# EAGLE design RPi-UKHASnet-node (EAGLE 7.4.0)
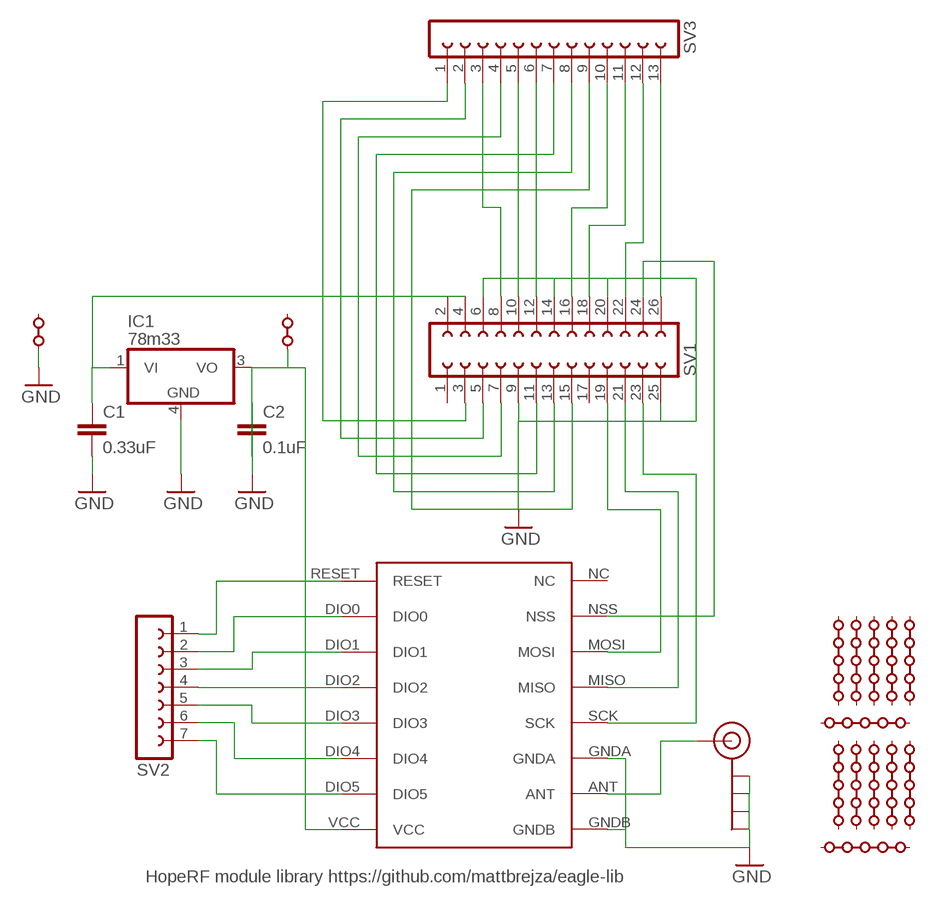
[diagram p0: schematic, sheet 1]

## Parts
C1  0.33uF  C-EUC1206  [C1206]
C2  0.1uF  C-EUC1206  [C1206]
IC1  78m33  LM340MP-05  [SOT223]
J$1  SMA_EDGE  [SMA-EDGE]
P1  PADSTRIP5-VA  [PADSTRIP-5V]
P2  PADSTRIP5-VA  [PADSTRIP-5V]
P3  PADSTRIP5-VA  [PADSTRIP-5V]
P4  PADSTRIP5-VA  [PADSTRIP-5V]
P5  PADSTRIP5-VA  [PADSTRIP-5V]
P9  PADSTRIP5-VA  [PADSTRIP-5V]
P10  PADSTRIP5-VA  [PADSTRIP-5V]
P11  PADSTRIP5-VA  [PADSTRIP-5V]
P12  PADSTRIP5-VA  [PADSTRIP-5V]
P13  PADSTRIP5-VA  [PADSTRIP-5V]
P17  PADSTRIP5-VA  [PADSTRIP-5V]
P18  PADSTRIP5-VA  [PADSTRIP-5V]
PR8  PADSTRIP2-H  [PADSTRIP-2H]
PR20  PADSTRIP2-H  [PADSTRIP-2H]
SV1  FE13-2  [FE13-2]
SV2  FE07-1  [FE07]
SV3  FE13-1  [FE13]
U1  RFM69HW  [RFM]

## Nets
GND: C1.2 C2.1 IC1.4(GND) J$1.GND@0(GND) J$1.GND@1(GND) J$1.GND@2(GND) J$1.GND@3(GND) PR20.1(LFT) SV1.6 SV1.9 SV1.14 SV1.20 SV1.25 U1.GNDA U1.GNDB
N$1: J$1.SIG(SIGNAL) U1.ANT
N$2: SV2.7 U1.DIO5
N$3: SV2.6 U1.DIO4
N$4: SV2.5 U1.DIO3
N$5: SV2.4 U1.DIO2
N$6: SV2.3 U1.DIO1
N$7: SV2.2 U1.DIO0
N$8: SV1.24 U1.NSS
N$9: SV1.23 U1.SCK
N$10: SV1.21 U1.MISO
N$11: SV1.19 U1.MOSI
N$12: SV1.3 SV3.1
N$13: C1.1 IC1.1(VI) SV1.2 SV1.4
N$14: C2.2 IC1.3(VO) PR8.1(LFT) U1.VCC
N$15: SV2.1 U1.RESET
N$16: SV1.5 SV3.2
N$17: SV1.7 SV3.4
N$18: SV1.11 SV3.7
N$19: SV1.13 SV3.8
N$20: SV1.15 SV3.9
N$21: SV1.8 SV3.3
N$22: SV1.10 SV3.5
N$23: SV1.12 SV3.6
N$24: SV1.16 SV3.10
N$25: SV1.18 SV3.11
N$26: SV1.22 SV3.12
N$27: SV1.26 SV3.13
Unconnected: P1.1 P1.5 P2.1 P2.5 P3.1 P3.5 P4.1 P4.5 P5.1 P5.5 P9.1 P9.5 P10.1 P10.5 P11.1 P11.5 P12.1 P12.5 P13.1 P13.5 P17.1 P17.5 P18.1 P18.5 PR8.2(RIT) PR20.2(RIT) SV1.1 SV1.17 U1.NC

## Notes on the sheet
- HopeRF module library https://github.com/mattbrejza/eagle-lib

## Library data of the parts
C1 C2 = rcl:C-EU: CAPACITOR, European symbol
IC1 = linear:LM340?-*: Positive VOLTAGE REGULATOR Source: http://cache.national.com/ds/LM/LM340.pdf
J$1 = SparkFun-Connectors:SMA_EDGE: SMA Antenna Connector End launch SMA connector. The paste layer has been removed so that the connector can be hand soldered onto the board after reflow.
P1-P5 P9-P13 P17 P18 = proto:PADSTRIP5-V: Strip of 5 connected pads; BOM: no; VALSTAT: label
PR8 PR20 = proto:PADSTRIP2-H: Strip of 2 connected pads; BOM: no; VALSTAT: label
SV1 = con-lsta:FE13-2: FEMALE HEADER; OC_FARNELL: unknown; OC_NEWARK: unknown
SV2 = con-lsta:FE07-1: FEMALE HEADER; OC_FARNELL: unknown; OC_NEWARK: unknown
SV3 = con-lsta:FE13-1: FEMALE HEADER; OC_FARNELL: unknown; OC_NEWARK: unknown
U1 = hoperf:RFM69HW

## Board
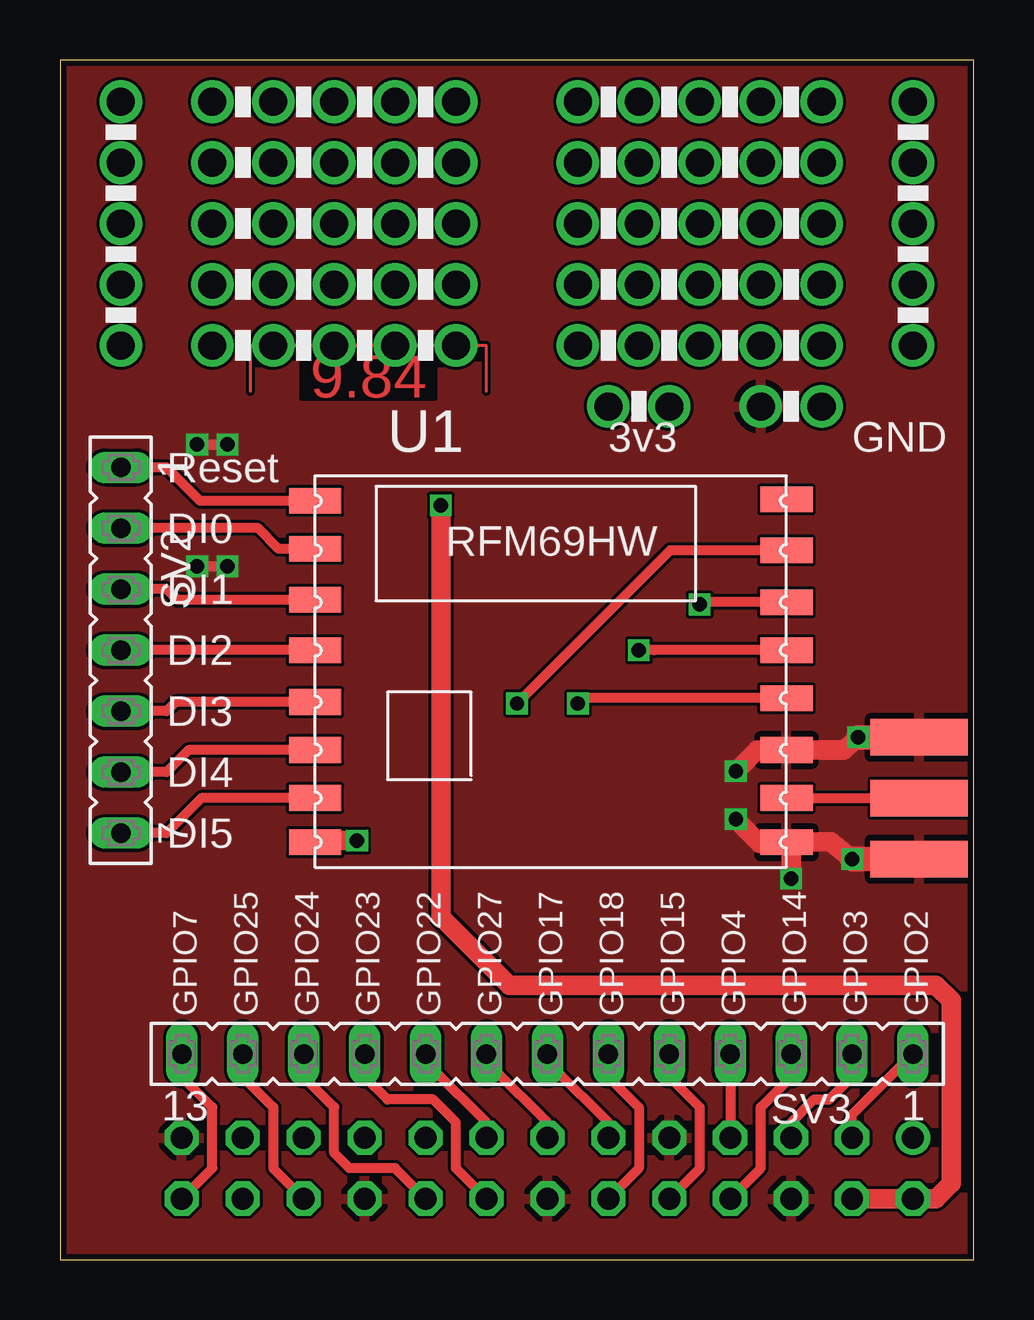
[diagram p1: board, top side]
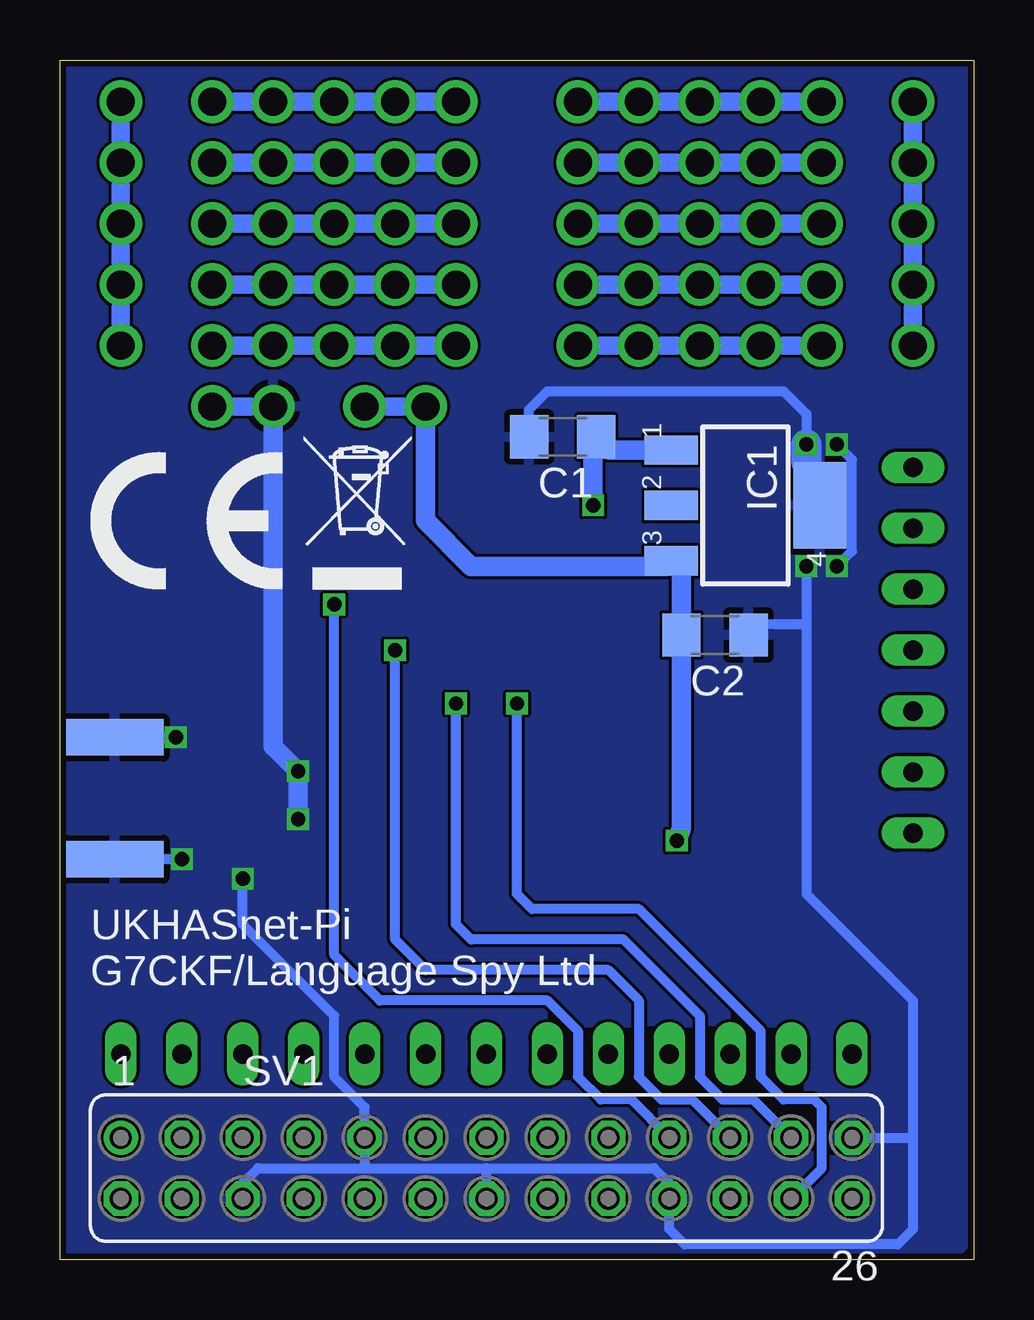
[diagram p2: board, bottom side, seen from below]

Size 38.1 x 50 mm. Coordinates in mm from the lower left corner, seen from the top.
Outline: 0,0 38.1,0 38.1,50 0,50 0,0
Copper layers (1*16): Top 0.035mm / dielectric 1.5mm / Bottom 0.035mm
Design rules "dirt_cheap_dirty_boards.v1": minimum track width 5mil, minimum drill 12mil, track to track 5mil, track to pad 5mil, pad to pad 5mil, via to via 5mil, smd to smd 0mil, copper to edge 10mil, drill to drill 10mil, minimum pad ring 10mil, minimum via ring 6mil, stop-mask expansion 2mil, vias tented up to drill 25mil, thermal gap 10mil

### Footprints (pad centres in the part's own frame; a part is rotated, then mirrored left to right if it is on the bottom)
C1206 = smd 1.6 x 1.8: 1 -1.4,0; 2 1.4,0
SOT223 = smd 1.219 x 2.235: 1 -2.311,-3.099; 2 0,-3.099; 3 2.311,-3.099 | smd 3.6 x 2.2: 4 0,3.099
SMA-EDGE = smd 1.524 x 4.064: GND@0 0,0; GND@1 5.08,0; SIG 2.54,0 | smd 1.524 x 4.064 bottom: GND@2 0,0; GND@3 5.08,0
PADSTRIP-5V = drill 1.168 pad 1.778: 1 0,5.08; 2 0,2.54; 3 0,0; 4 0,-2.54; 5 0,-5.08
PADSTRIP-2H = drill 1.168 pad 1.778: 1 0,0; 2 2.54,0
FE13-2 = drill 0.914: 1 -15.24,1.27 | drill 0.914 octagon: 2 -15.24,-1.27; 3 -12.7,1.27; 4 -12.7,-1.27; 5 -10.16,1.27; 6 -10.16,-1.27; 7 -7.62,1.27; 8 -7.62,-1.27; 9 -5.08,1.27; 10 -5.08,-1.27; 11 -2.54,1.27; 12 -2.54,-1.27; 13 0,1.27; 14 0,-1.27; 15 2.54,1.27; 16 2.54,-1.27; 17 5.08,1.27; 18 5.08,-1.27; 19 7.62,1.27; 20 7.62,-1.27; 21 10.16,1.27; 22 10.16,-1.27; 23 12.7,1.27; 24 12.7,-1.27; 25 15.24,1.27; 26 15.24,-1.27
FE07 = drill 0.813 long: 1 -7.62,0; 2 -5.08,0; 3 -2.54,0; 4 0,0; 5 2.54,0; 6 5.08,0; 7 7.62,0
FE13 = drill 0.813 long: 1 -15.24,0; 2 -12.7,0; 3 -10.16,0; 4 -7.62,0; 5 -5.08,0; 6 -2.54,0; 7 0,0; 8 2.54,0; 9 5.08,0; 10 7.62,0; 11 10.16,0; 12 12.7,0; 13 15.24,0
RFM = smd 2.184 x 1.067: ANT 19.651,2.889; DIO0 0,13.27; DIO1 0,11.143; DIO2 0,9.047; DIO3 0,6.889; DIO4 0,4.889; DIO5 0,2.889; GNDA 19.651,4.889; GNDB 19.651,1.048; MISO 19.651,9.047; MOSI 19.651,11.047; NC 19.651,15.334; NSS 19.651,13.206; RESET 0,15.27; SCK 19.651,7.048; VCC 0,1.048

### Placement (x,y rotation side)
C1  17.14,34.29 180 bottom
C2  10.79,26.04 180 bottom
IC1  9.53,31.43 270 bottom
J$1  35.81,16.69 90 top
P1  11.43,48.26 90 top
P2  11.43,45.72 90 top
P3  11.43,43.18 90 top
P4  11.43,40.64 90 top
P5  11.43,38.1 90 top
P9  26.67,48.26 90 top
P10  26.67,45.72 90 top
P11  26.67,43.18 90 top
P12  26.67,40.64 90 top
P13  26.67,38.1 90 top
P17  2.54,43.18 0 top
P18  35.56,43.18 0 top
PR8  22.86,35.56 0 top
PR20  29.21,35.56 0 top
SV1  20.32,3.81 0 bottom
SV2  2.54,25.4 270 top
SV3  20.32,8.57 180 top
U1  10.63,16.35 0 top
U$2  [CE-LOGO]  36.83,27.94 0 bottom
U$3  [WEE-LOGO]  27.94,27.94 0 bottom

### Tracks (layer width: path | path; a pad name or v marks a point on that pad's centre or on a via)
GND  (via drill 0.6)
  Top 0.406: v6.99,28.89 v5.71,28.89 | v5.71,33.97 v6.99,33.97
  Top 0.813: U1.GNDB 32.13,17.4 v33.02,16.69 | v33.27,21.77 32.67,21.24 U1.GNDA 29.06,21.24 v28.18,20.35 | v28.18,18.35 29.18,17.35 30.24,17.35 U1.GNDB | v30.48,15.88 30.48,17.2 U1.GNDB
  Top 1.016: v33.02,16.69 J$1.GND@2 | v33.27,21.77 J$1.GND@3
  Bottom 0.406: J$1.GND@3 v33.27,21.77 | J$1.GND@2 v33.02,16.69 | SV1.6 30.48,3.17 29.84,3.81 25.4,3.81 | 25.4,3.81 20.32,3.81 | 20.32,3.81 13.34,3.81 12.7,3.17 SV1.20 12.7,1.27 12.06,0.64 3.17,0.64 2.54,1.27 2.54,5.08 | SV1.14 20.32,3.81 | 25.4,3.81 SV1.9 25.4,6.35 26.67,7.62 26.67,10.16 30.48,13.97 v30.48,15.88 | v5.71,28.89 5.08,29.53 5.08,33.34 v5.71,33.97 | 6.99,33.26 IC1.4 | C2.1 9.39,26.48 7.12,26.48 6.99,26.35 | C1.2 18.55,35.43 17.78,36.2 7.94,36.2 6.99,35.24 v6.99,33.97 | SV1.25 2.54,5.08 | v6.99,28.89 6.99,26.35 | 6.99,26.35 6.99,15.24 2.54,10.79 2.54,5.08
  Bottom 0.813: v28.18,18.35 v28.18,20.35 29.21,21.39 PR20.1
  Bottom 1.27: v6.99,33.97 6.99,33.26
  pour Top: 0,50 38.1,50 38.1,0 0,0
  pour Bottom: 1,0 0,1 0,50 38,50 38,0
N$1
  Top 0.406: U1.ANT J$1.SIG
N$2
  Top 0.406: U1.DIO5 5.9,19.24 4.45,17.78 SV2.7
N$3
  Top 0.406: U1.DIO4 5.36,21.24 4.45,20.32 SV2.6
N$4
  Top 0.406: U1.DIO3 4.82,23.24 4.45,22.86 SV2.5
N$5
  Top 0.406: U1.DIO2 SV2.4
N$6
  Top 0.406: U1.DIO1 4.89,27.49 4.45,27.94 SV2.3
N$7
  Top 0.406: U1.DIO0 9.12,29.62 8.26,30.48 SV2.2
N$8  (via drill 0.6)
  Top 0.406: U1.NSS 25.43,29.56 v19.05,23.18
  Bottom 0.406: v19.05,23.18 19.05,15.24 18.41,14.61 13.97,14.61 8.89,9.53 8.89,7.62 7.94,6.67 6.67,6.67 6.35,6.35 6.35,3.81 SV1.24
N$9  (via drill 0.6)
  Top 0.406: U1.SCK 21.81,23.4 v21.59,23.18
  Bottom 0.406: v21.59,23.18 21.59,13.97 20.95,13.34 14.61,13.34 11.43,10.16 11.43,7.62 10.48,6.67 9.21,6.67 SV1.23
N$10  (via drill 0.6)
  Top 0.406: U1.MISO 24.76,25.4 v24.13,25.4
  Bottom 0.406: v24.13,25.4 24.13,13.34 22.86,12.06 15.24,12.06 13.97,10.79 13.97,7.62 13.02,6.67 11.75,6.67 SV1.21
N$11  (via drill 0.6)
  Top 0.406: U1.MOSI 26.76,27.4 v26.67,27.3
  Bottom 0.406: v26.67,27.3 26.67,12.7 24.77,10.79 17.78,10.79 16.51,9.53 16.51,7.62 15.56,6.67 14.29,6.67 SV1.19
N$12
  Top 0.406: SV1.3 33.02,6.03 SV3.1
N$13  (via drill 0.6)
  Top 0.813: SV1.4 SV1.2 36.51,2.54 37.15,3.17 37.15,10.79 36.51,11.43 18.73,11.43 15.88,14.29 v15.88,31.43
  Bottom 0.813: v15.88,31.43 15.88,34.29 15.74,34.42 C1.1 15.2,33.74 IC1.1
N$14  (via drill 0.6)
  Top 0.813: v12.38,17.46 11.43,17.46 11.37,17.4 U1.VCC
  Bottom 0.813: PR8.1 22.86,30.8 20.95,28.89 12.85,28.89 IC1.3 12.2,28.69 C2.2 12.2,17.97 v12.38,17.46
N$15
  Top 0.406: U1.RESET 5.84,31.62 4.45,33.02 SV2.1
N$16
  Top 0.406: SV1.5 30.48,5.71 31.43,6.67 32.07,6.67 33.02,7.62 SV3.2
N$17
  Top 0.406: SV3.4 SV1.7
N$18
  Top 0.406: SV1.11 22.86,5.71 20.64,7.94 20.32,7.94 SV3.7
N$19
  Top 0.406: SV1.13 20.32,5.71 18.1,7.94 18.1,8.26 SV3.8
N$20
  Top 0.406: SV1.15 17.78,5.71 15.56,7.94 15.56,8.26 SV3.9
N$21
  Top 0.406: SV1.8 29.21,3.81 29.21,6.35 30.48,7.62 SV3.3
N$22
  Top 0.406: SV1.10 26.67,3.81 26.67,6.35 25.4,7.62 SV3.5
N$23
  Top 0.406: SV1.12 24.13,3.81 24.13,6.35 22.86,7.62 SV3.6
N$24
  Top 0.406: SV1.16 16.51,3.81 16.51,5.71 15.56,6.67 13.65,6.67 12.7,7.62 SV3.10
N$25
  Top 0.406: SV1.18 13.97,3.81 12.06,3.81 11.43,4.45 11.43,6.35 10.16,7.62 SV3.11
N$26
  Top 0.406: SV1.22 8.89,3.81 8.89,6.35 7.62,7.62 SV3.12
N$27
  Top 0.406: SV1.26 6.35,3.81 6.35,6.35 5.08,7.62 SV3.13
(copper drawn outside any net)
  shapes: Top area x1

### Text on the board
tPlace: 3v3 | GND | Reset | DI0 | DI1 | DI2 | DI3 | DI4 | DI5 | GPIO7 | GPIO25 | GPIO24 | GPIO23 | GPIO22 | GPIO27 | GPIO17 | GPIO18 | GPIO15 | GPIO4 | GPIO14 | GPIO3 | GPIO2
bPlace: UKHASnet-Pi / G7CKF/Language Spy Ltd